# EAGLE schematic board_v0.1 (EAGLE 9.6.2)
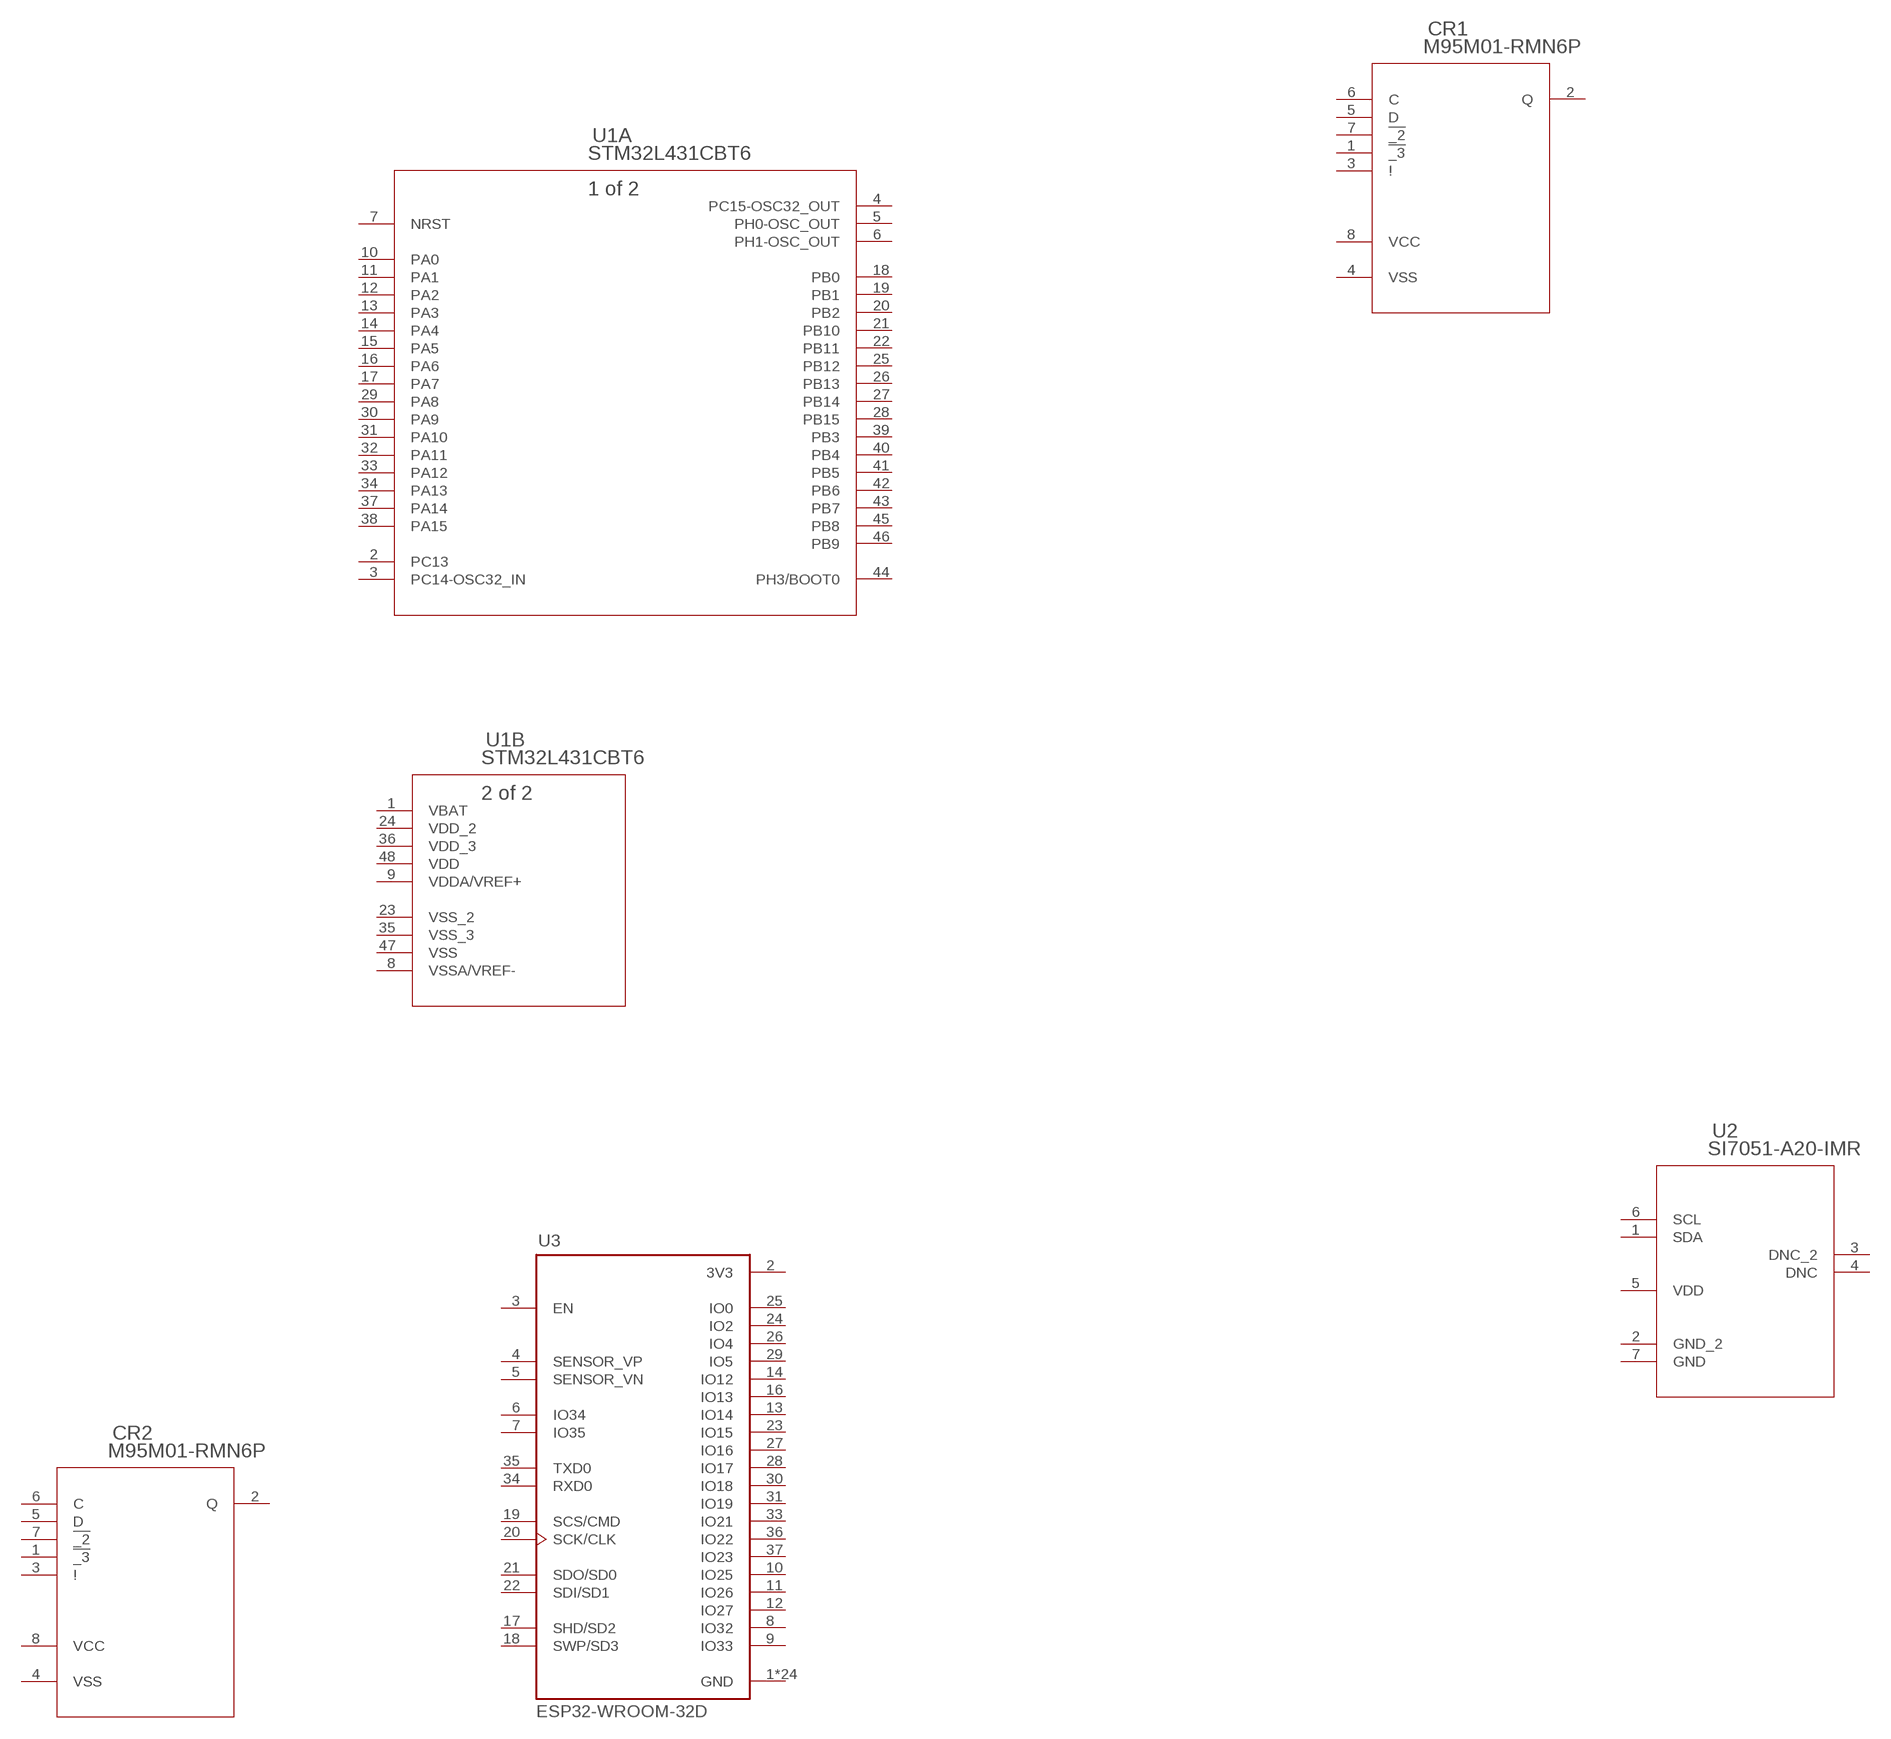
[diagram p0: schematic, sheet 1]

## Parts
CR1  M95M01-RMN6P  [SO-8_STM]
CR2  M95M01-RMN6P  [SO-8_STM]
U1  STM32L431CBT6  [LQFP-48]
U2  SI7051-A20-IMR  [DFN6_SIL]
U3  ESP32-WROOM-32D  [MODULE_ESP32-WROOM-32D]
U$1  MMC5603NJ4-UFBGA  [BGA4N40P2X2_82X82X60N]  (not placed on a sheet)
Unconnected: CR1.1(!_3) CR1.2(Q) CR1.3(!) CR1.5(D) CR1.6(C) CR1.7(!_2) CR2.1(!_3) CR2.2(Q) CR2.3(!) CR2.5(D) CR2.6(C) CR2.7(!_2) U1.2(A:PC13) U1.3(A:PC14-OSC32_IN) U1.4(A:PC15-OSC32_OUT) U1.5(A:PH0-OSC_OUT) U1.6(A:PH1-OSC_OUT) U1.7(A:NRST) U1.10(A:PA0) U1.11(A:PA1) U1.12(A:PA2) U1.13(A:PA3) U1.14(A:PA4) U1.15(A:PA5) U1.16(A:PA6) U1.17(A:PA7) U1.18(A:PB0) U1.19(A:PB1) U1.20(A:PB2) U1.21(A:PB10) U1.22(A:PB11) U1.25(A:PB12) U1.26(A:PB13) U1.27(A:PB14) U1.28(A:PB15) U1.29(A:PA8) U1.30(A:PA9) U1.31(A:PA10) U1.32(A:PA11) U1.33(A:PA12) U1.34(A:PA13) U1.37(A:PA14) U1.38(A:PA15) U1.39(A:PB3) U1.40(A:PB4) U1.41(A:PB5) U1.42(A:PB6) U1.43(A:PB7) U1.44(A:PH3/BOOT0) U1.45(A:PB8) U1.46(A:PB9) U2.1(SDA) U2.2(GND_2) U2.3(DNC_2) U2.4(DNC) U2.6(SCL) U2.7(GND) U3.3(EN) U3.4(SENSOR_VP) U3.5(SENSOR_VN) U3.6(IO34) U3.7(IO35) U3.8(IO32) U3.9(IO33) U3.10(IO25) U3.11(IO26) U3.12(IO27) U3.13(IO14) U3.14(IO12) U3.16(IO13) U3.17(SHD/SD2) U3.18(SWP/SD3) U3.19(SCS/CMD) U3.20(SCK/CLK) U3.21(SDO/SD0) U3.22(SDI/SD1) U3.23(IO15) U3.24(IO2) U3.25(IO0) U3.26(IO4) U3.27(IO16) U3.28(IO17) U3.29(IO5) U3.30(IO18) U3.31(IO19) U3.33(IO21) U3.34(RXD0) U3.35(TXD0) U3.36(IO22) U3.37(IO23)

## Power pins joined to a net without a drawn wire
3V3: U3.2(3V3)
GND: U3.1(GND) U3.15(GND) U3.38(GND) U3.39_1(GND) U3.39_2(GND) U3.39_3(GND) U3.39_4(GND) U3.39_5(GND) U3.39_6(GND) U3.39_7(GND) U3.39_8(GND) U3.39_9(GND) U3.39_10(GND) U3.39_11(GND) U3.39_12(GND) U3.39_13(GND) U3.39_14(GND) U3.39_15(GND) U3.39_16(GND) U3.39_17(GND) U3.39_18(GND) U3.39_19(GND) U3.39_20(GND) U3.39_21(GND)
VBAT: U1.1(B:VBAT)
VCC: CR1.8(VCC) CR2.8(VCC)
VDD: U1.48(B:VDD) U2.5(VDD)
VDD_2: U1.24(B:VDD_2)
VDD_3: U1.36(B:VDD_3)
VDDA/VREF+: U1.9(B:VDDA/VREF+)
VSS: CR1.4(VSS) CR2.4(VSS) U1.47(B:VSS)
VSS_2: U1.23(B:VSS_2)
VSS_3: U1.35(B:VSS_3)
VSSA/VREF-: U1.8(B:VSSA/VREF-)

## Library data of the parts
CR1 CR2 = M95M01-RDW6TP:M95M01-RMN6P; BUILT_BY: EMA_UL_Team; MANUFACTURER_PART_NUMBER: M95M01-RMN6P; SOURCELIBRARY: StMicro_2011-06-07; VENDOR: STMicroelectronics
U1 = STM32L431CBT6:STM32L431CBT6; BUILT_BY: EMA_UL_Team; COPYRIGHT: Copyright (C) 2018 Accelerated Designs. All rights reserved; MANUFACTURER_PART_NUMBER: STM32L431CBT6; SOURCELIBRARY: Updates_to_database_2020-10-19; VENDOR: STMicroelectronics
U2 = SI7051-A20-IMR:SI7051-A20-IMR; BUILT_BY: EMA_Cory; COPYRIGHT: Copyright (C) 2018 Accelerated Designs. All rights reserved; DATASHEET: https://www.silabs.com/documents/public/data-sheets/Si7050-1-3-4-5-A20.pdf; MANUFACTURER_PART_NUMBER: SI7051-A20-IMR; SOURCELIBRARY: Silicon_Labs_2020-04-03; VENDOR: Silicon Labs
U3 = ESP32-WROOM-32D-2:ESP32-WROOM-32D: Bluetooth, WiFi 802.11b/g/n, Bluetooth v4.2 + EDR, Class 1, 2 and 3 Transceiver Module 2.4GHz ~ 2.5GHz Integrated, Trace Surface Mount Check prices <https://pricing.snapeda.com/parts/ESP32-WROOM-32D/Espressif%20Systems/view-part?ref=eda>; AVAILABILITY: Bad; DESCRIPTION: Bluetooth, WiFi 802.11b/g/n, Bluetooth v4.2 +EDR, Class 1, 2 and 3 Transceiver Module 2.4GHz ~ 2.5GHz Integrated, Trace Surface Mount; MF: Espressif Systems; MP: ESP32-WROOM-32D; PACKAGE: Module Espressif Systems; PRICE: None
U$1 = MMC5603NJ:MMC5603NJ